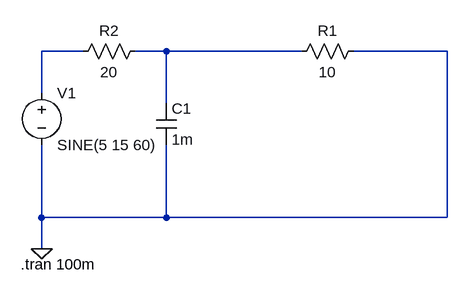
[diagram p0: schematic decoupling.asc]
decoupling.asc, the LTspice schematic file:
Version 4.1
SHEET 1 880 680
WIRE 48 16 -16 16
WIRE 176 16 128 16
WIRE 384 16 176 16
WIRE 608 16 464 16
WIRE -16 80 -16 16
WIRE 176 96 176 16
WIRE -16 272 -16 160
WIRE 176 272 176 160
WIRE 176 272 -16 272
WIRE 608 272 608 16
WIRE 608 272 176 272
WIRE -16 320 -16 272
FLAG -16 320 0
SYMBOL voltage -16 64 R0
WINDOW 123 0 0 Left 0
WINDOW 39 0 0 Left 0
SYMATTR InstName V1
SYMATTR Value SINE(5 15 60)
SYMBOL cap 160 96 R0
SYMATTR InstName C1
SYMATTR Value 1m
SYMBOL res 480 0 R90
WINDOW 0 0 56 VBottom 2
WINDOW 3 32 56 VTop 2
SYMATTR InstName R1
SYMATTR Value 10
SYMBOL res 144 0 R90
WINDOW 0 0 56 VBottom 2
WINDOW 3 32 56 VTop 2
SYMATTR InstName R2
SYMATTR Value 20
TEXT -48 344 Left 2 !.tran 100m

The netlist it stands for:
* decoupling.asc
V1 N001 0 SINE(5 15 60)
C1 N002 0 1m
R1 0 N002 10
R2 N002 N001 20
.tran 100m
.backanno
.end